# Altium schematic sheet BSC0802BOB.SchDoc
size A4
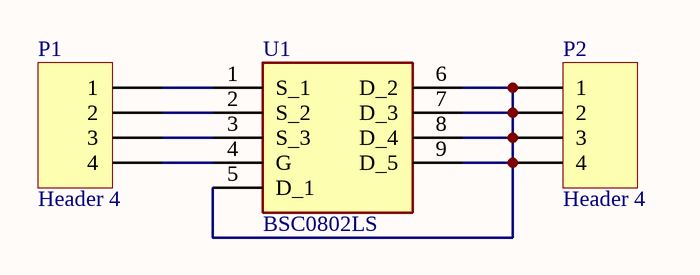
[diagram p0: BSC0802BOB.SchDoc]

## Parts
P1  Header 4  [HDR1X4]
P2  Header 4  [HDR1X4]
U1  BSC0802LS  [TDSON-8]

## Nets
NetP1_1: P1.1 U1.1(S_1)
NetP1_2: P1.2 U1.2(S_2)
NetP1_3: P1.3 U1.3(S_3)
NetP1_4: P1.4 U1.4(G)
NetP2_1: P2.1 P2.2 P2.3 P2.4 U1.5(D_1) U1.6(D_2) U1.7(D_3) U1.8(D_4) U1.9(D_5)

## Library data of the parts
P1 P2 = Header 4: Header, 4-Pin; LatestRevisionDate: 17-Jul-2002; LatestRevisionNote: Re-released for DXP Platform.; Publisher: Altium Limited